# EAGLE schematic 4x4-programmable-keypad (EAGLE 9.0.1)
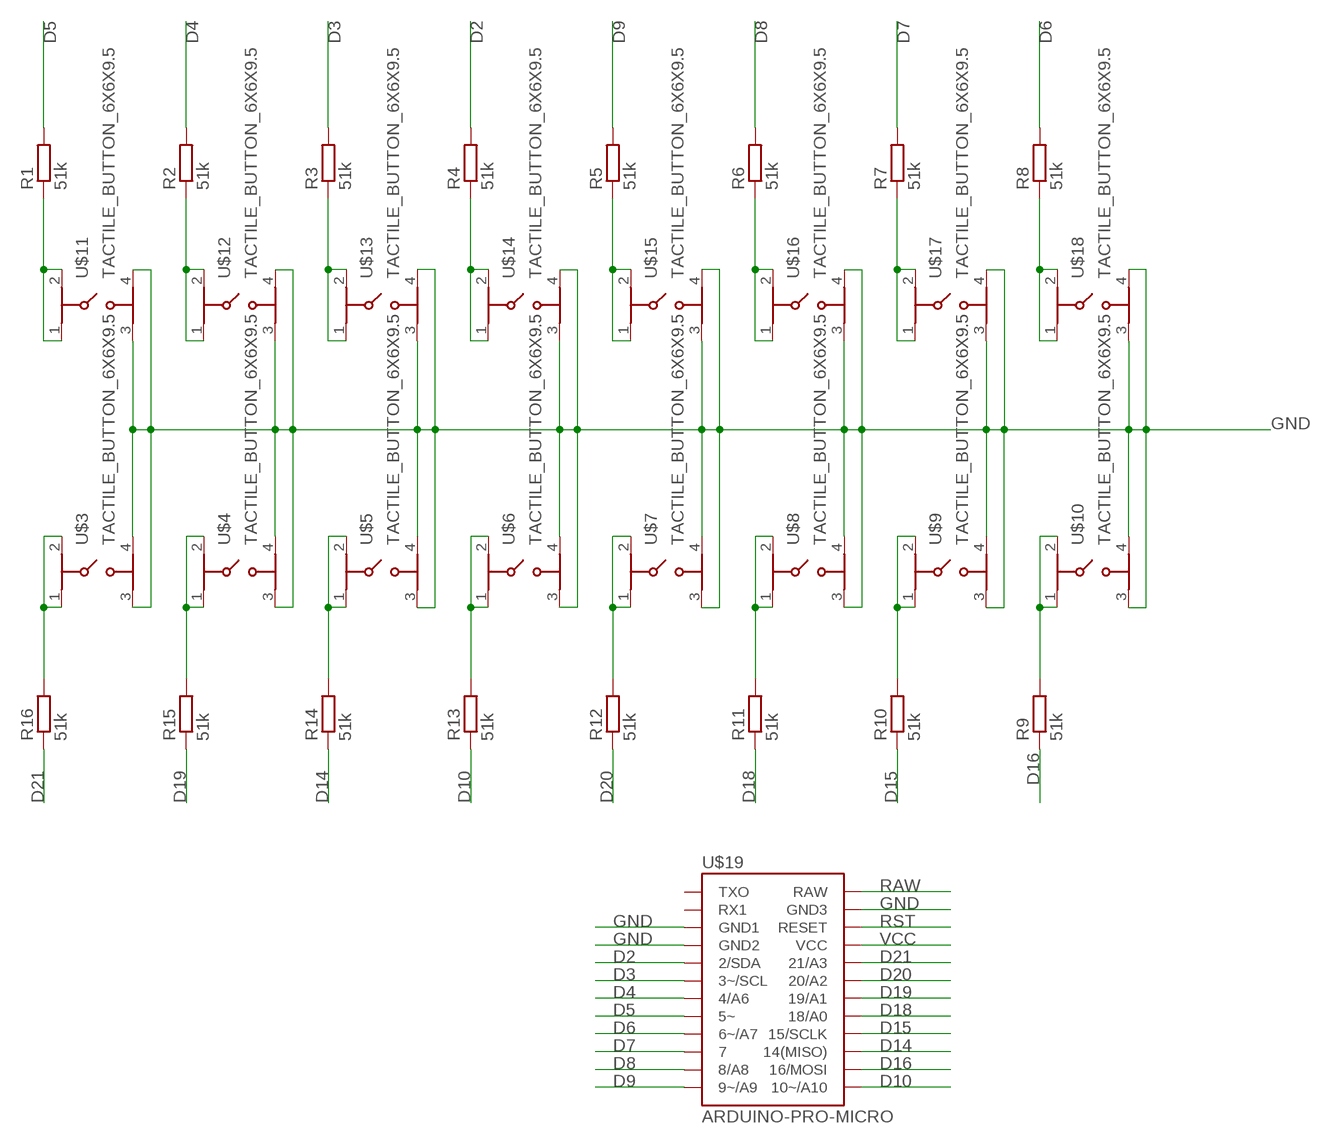
[diagram p0: schematic, sheet 1]

## Parts
R1  51k  R-EU_R0603  [R0603]
R2  51k  R-EU_R0603  [R0603]
R3  51k  R-EU_R0603  [R0603]
R4  51k  R-EU_R0603  [R0603]
R5  51k  R-EU_R0603  [R0603]
R6  51k  R-EU_R0603  [R0603]
R7  51k  R-EU_R0603  [R0603]
R8  51k  R-EU_R0603  [R0603]
R9  51k  R-EU_R0603  [R0603]
R10  51k  R-EU_R0603  [R0603]
R11  51k  R-EU_R0603  [R0603]
R12  51k  R-EU_R0603  [R0603]
R13  51k  R-EU_R0603  [R0603]
R14  51k  R-EU_R0603  [R0603]
R15  51k  R-EU_R0603  [R0603]
R16  51k  R-EU_R0603  [R0603]
U$3  TACTILE_BUTTON_6X6X9.5  [TACTILE_SWITCH_PTH_6.0MM]
U$4  TACTILE_BUTTON_6X6X9.5  [TACTILE_SWITCH_PTH_6.0MM]
U$5  TACTILE_BUTTON_6X6X9.5  [TACTILE_SWITCH_PTH_6.0MM]
U$6  TACTILE_BUTTON_6X6X9.5  [TACTILE_SWITCH_PTH_6.0MM]
U$7  TACTILE_BUTTON_6X6X9.5  [TACTILE_SWITCH_PTH_6.0MM]
U$8  TACTILE_BUTTON_6X6X9.5  [TACTILE_SWITCH_PTH_6.0MM]
U$9  TACTILE_BUTTON_6X6X9.5  [TACTILE_SWITCH_PTH_6.0MM]
U$10  TACTILE_BUTTON_6X6X9.5  [TACTILE_SWITCH_PTH_6.0MM]
U$11  TACTILE_BUTTON_6X6X9.5  [TACTILE_SWITCH_PTH_6.0MM]
U$12  TACTILE_BUTTON_6X6X9.5  [TACTILE_SWITCH_PTH_6.0MM]
U$13  TACTILE_BUTTON_6X6X9.5  [TACTILE_SWITCH_PTH_6.0MM]
U$14  TACTILE_BUTTON_6X6X9.5  [TACTILE_SWITCH_PTH_6.0MM]
U$15  TACTILE_BUTTON_6X6X9.5  [TACTILE_SWITCH_PTH_6.0MM]
U$16  TACTILE_BUTTON_6X6X9.5  [TACTILE_SWITCH_PTH_6.0MM]
U$17  TACTILE_BUTTON_6X6X9.5  [TACTILE_SWITCH_PTH_6.0MM]
U$18  TACTILE_BUTTON_6X6X9.5  [TACTILE_SWITCH_PTH_6.0MM]
U$19  ARDUINO-PRO-MICRO  [SPARKFUN_PRO_MICRO]

## Nets
D2: R4.2 U$19.2/SDA
D3: R3.2 U$19.3~/SCL
D4: R2.2 U$19.4/A6
D5: R1.2 U$19.5~
D6: R8.2 U$19.6~/A7
D7: R7.2 U$19.7
D8: R6.2 U$19.8/A8
D9: R5.2 U$19.9~/A9
D10: R13.1 U$19.10~/A10
D14: R14.1 U$19.14/MISO(14(MISO))
D15: R10.1 U$19.15/SCLK
D16: R9.1 U$19.16/MOSI
D18: R11.1 U$19.18/A0
D19: R15.1 U$19.19/A1
D20: R12.1 U$19.20/A2
D21: R16.1 U$19.21/A3
GND: U$3.3 U$3.4 U$4.3 U$4.4 U$5.3 U$5.4 U$6.3 U$6.4 U$7.3 U$7.4 U$8.3 U$8.4 U$9.3 U$9.4 U$10.3 U$10.4 U$11.3 U$11.4 U$12.3 U$12.4 U$13.3 U$13.4 U$14.3 U$14.4 U$15.3 U$15.4 U$16.3 U$16.4 U$17.3 U$17.4 U$18.3 U$18.4 U$19.GND1 U$19.GND2 U$19.GND3
N2: R16.2 U$3.1 U$3.2
N3: R12.2 U$7.1 U$7.2
N4: R15.2 U$4.1 U$4.2
N5: R11.2 U$8.1 U$8.2
N6: R10.2 U$9.1 U$9.2
N7: R9.2 U$10.1 U$10.2
N8: R14.2 U$5.1 U$5.2
N9: R13.2 U$6.1 U$6.2
N10: R1.1 U$11.1 U$11.2
N14: R3.1 U$13.1 U$13.2
N15: R4.1 U$14.1 U$14.2
N16: R2.1 U$12.1 U$12.2
N18: R5.1 U$15.1 U$15.2
N19: R6.1 U$16.1 U$16.2
N20: R7.1 U$17.1 U$17.2
N21: R8.1 U$18.1 U$18.2
RAW: U$19.RAW
RST: U$19.RST(RESET)
VCC: U$19.VCC
Unconnected: U$19.RX1 U$19.TX0(TXO)

## Library data of the parts
R1-R16 = rcl:R-EU_: RESISTOR, European symbol; SPICEPREFIX: R
U$3-U$18 = Pat Sonstiges:TACTILE_BUTTON_6X6X9.5
U$19 = My Boards:ARDUINO-PRO-MICRO